# Altium schematic sheet SMAconnections.SchDoc
size 297 x 209 mm
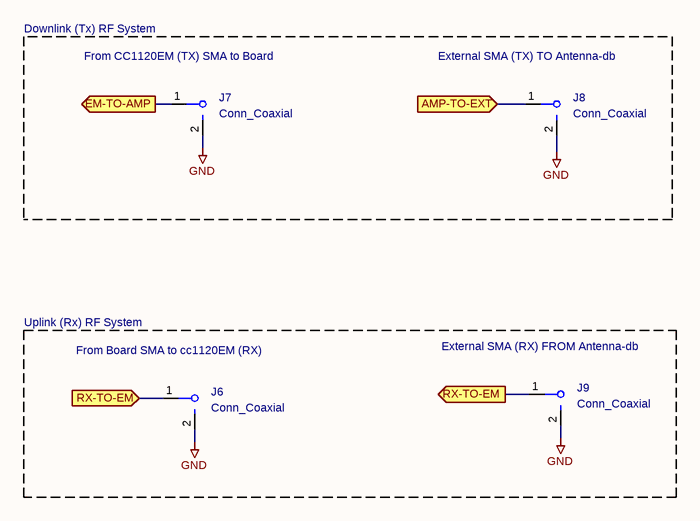
[diagram p0: SMAconnections.SchDoc]

## Parts
J6  Conn_Coaxial  [SMA_Amphenol_132134-10_Vertical]
J7  Conn_Coaxial  [SMA_Amphenol_132134-10_Vertical]
J8  Conn_Coaxial  [SMA_Amphenol_132134-10_Vertical]
J9  Conn_Coaxial  [SMA_Amphenol_132134-10_Vertical]

## Ports
AMP-TO-EXT (in), EM-TO-AMP (out), RX-TO-EM (in), RX-TO-EM (out)

## Nets
GND: J6.2(Ext) J7.2(Ext) J8.2(Ext) J9.2(Ext)
AMP-TO-EXT: J8.1(In) ; port AMP-TO-EXT
EM-TO-AMP: J7.1(In) ; port EM-TO-AMP
RX-TO-EM: J6.1(In) J9.1(In) ; port RX-TO-EM

## Notes on the sheet
- Downlink (Tx) RF System
- (near J7) From CC1120EM (TX) SMA to Board
- (near J8) External SMA (TX) TO Antenna-db
- Uplink (Rx) RF System
- (near J6) From Board SMA to cc1120EM (RX)
- (near J9) External SMA (RX) FROM Antenna-db
- 1
- 2
- 3
- 4
- 5
- 6
- A
- B
- C
- D
- Title:
- File: SMAconnections.kicad_sch
- Sheet: /
- KiCad E.D.A.  kicad (5.1.4)-1
- Size: A4
- Date:
- Rev:
- Id: 1/1

## Library data of the parts
J6-J9 = Conn_Coaxial: Value: Conn_Coaxial; Footprint: Connector_Coaxial:SMA_Amphenol_132134-10_Vertical